# EAGLE board TESTOMATIC-v2_2 (EAGLE 9.7.0)
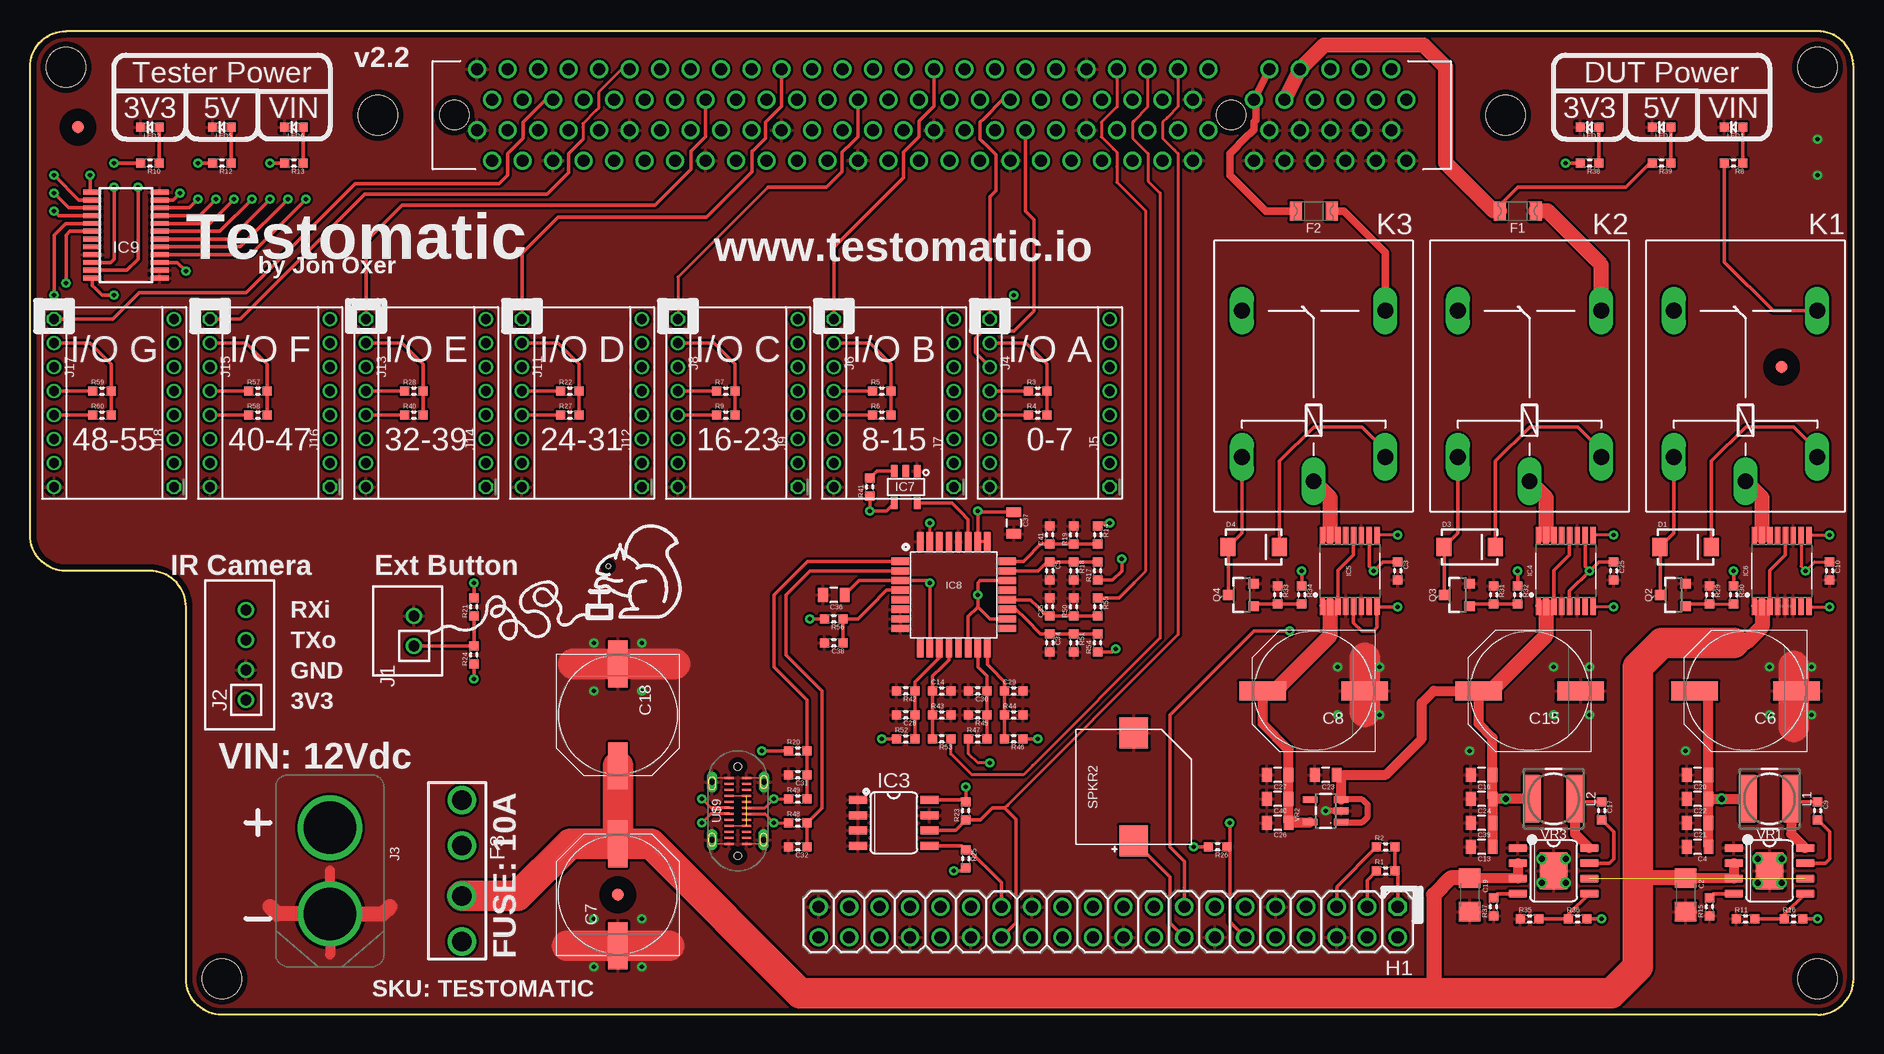
[diagram p4: board, top side]
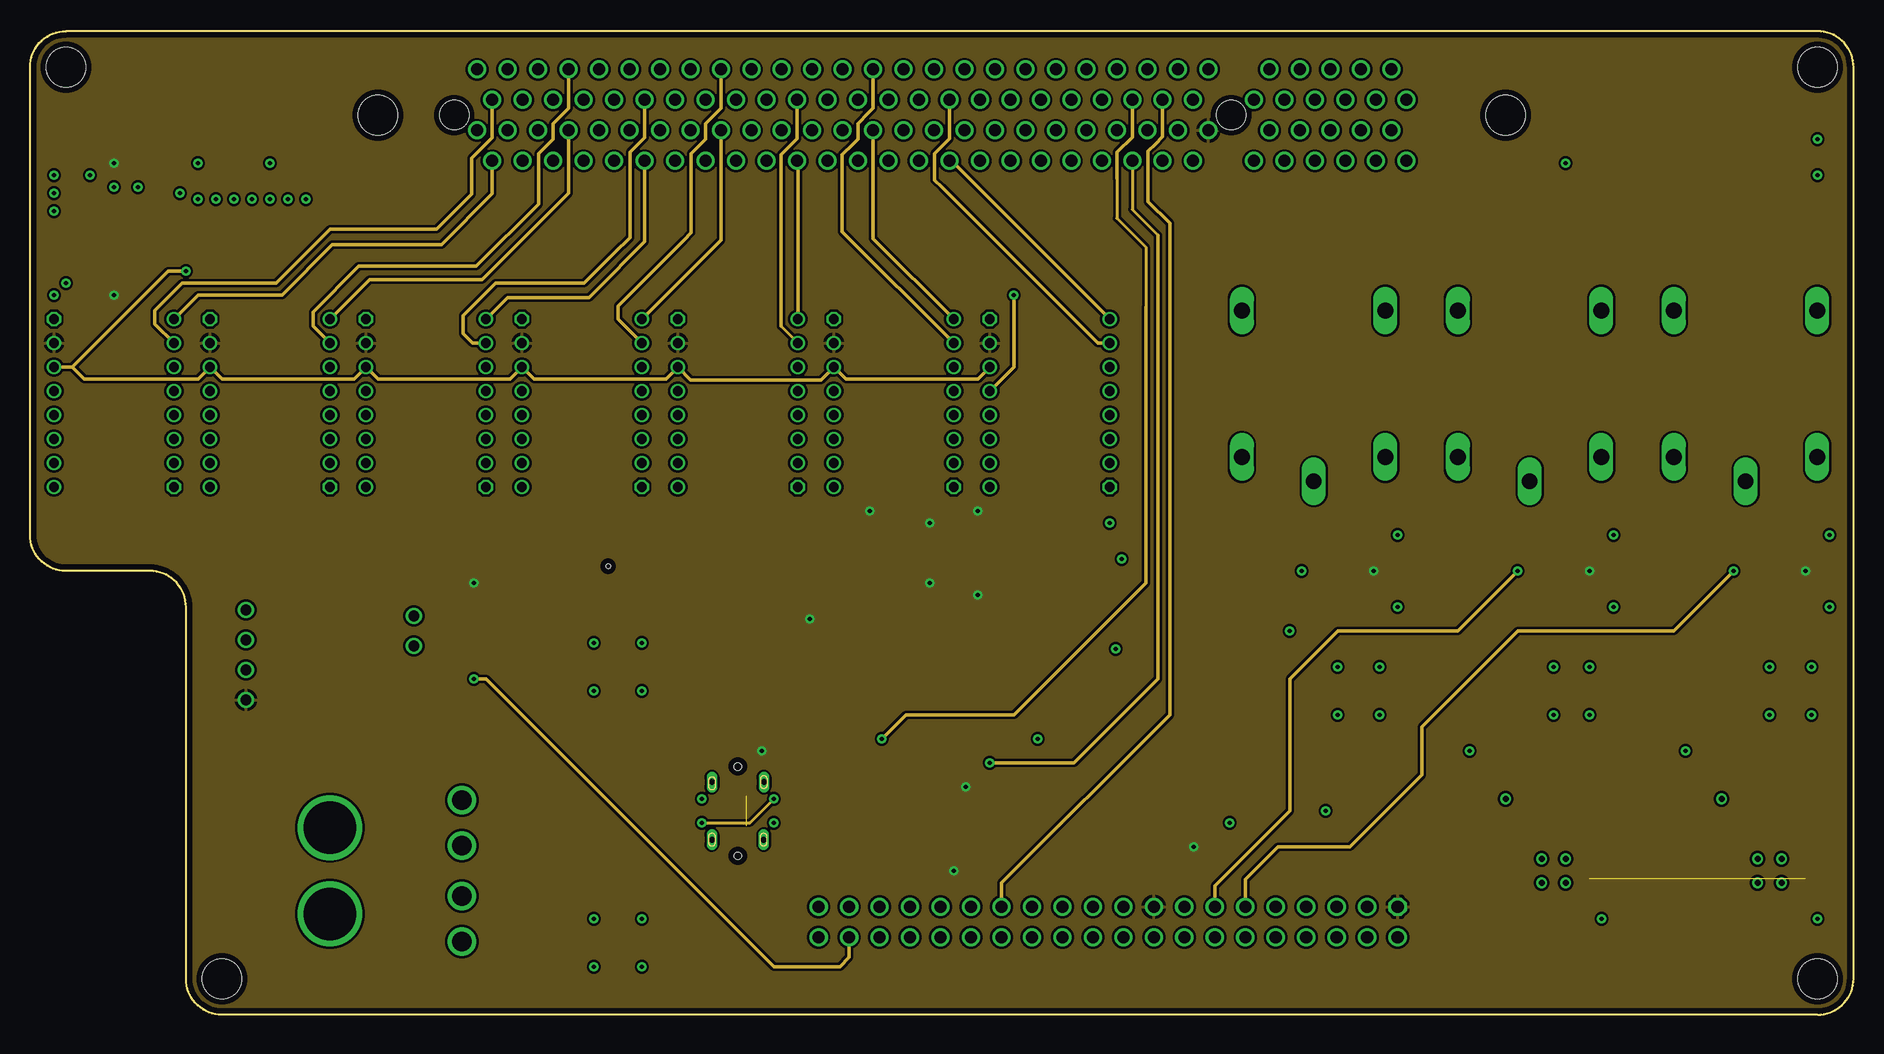
[diagram p5: board, inner layer Route2]
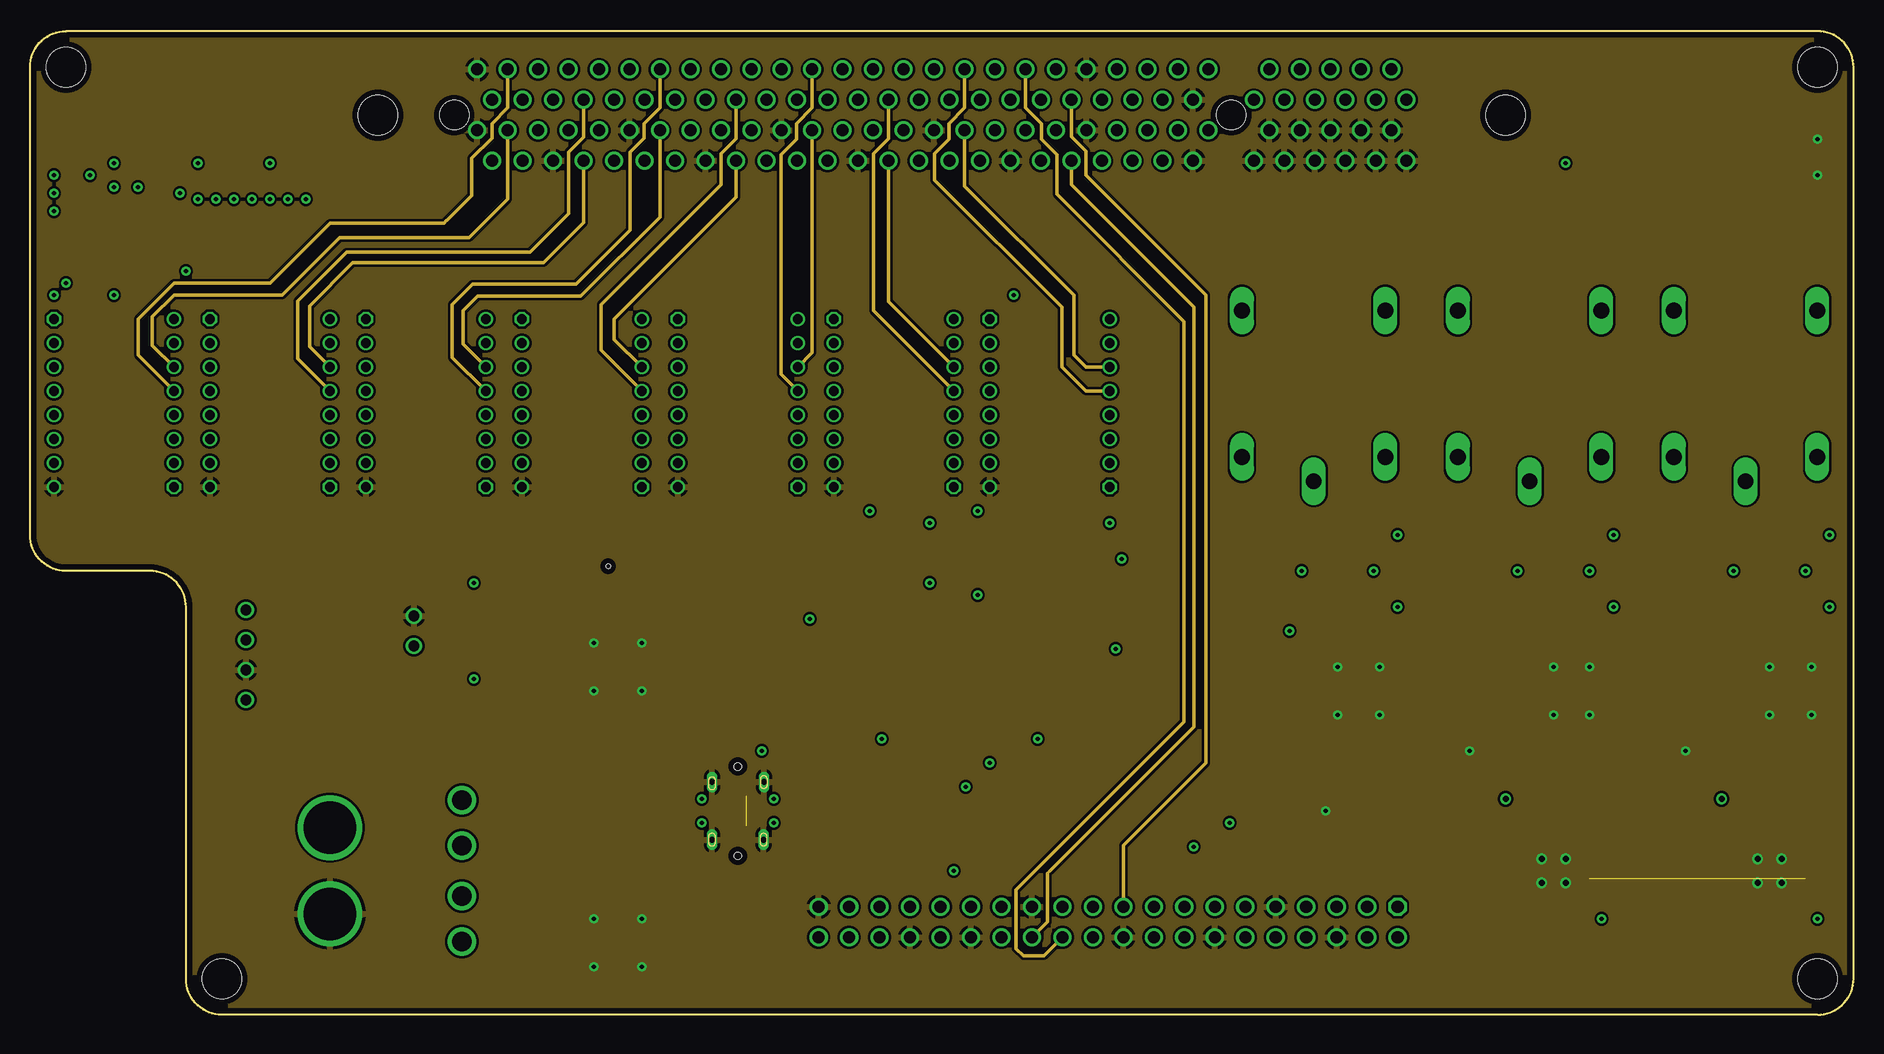
[diagram p6: board, inner layer Route3]
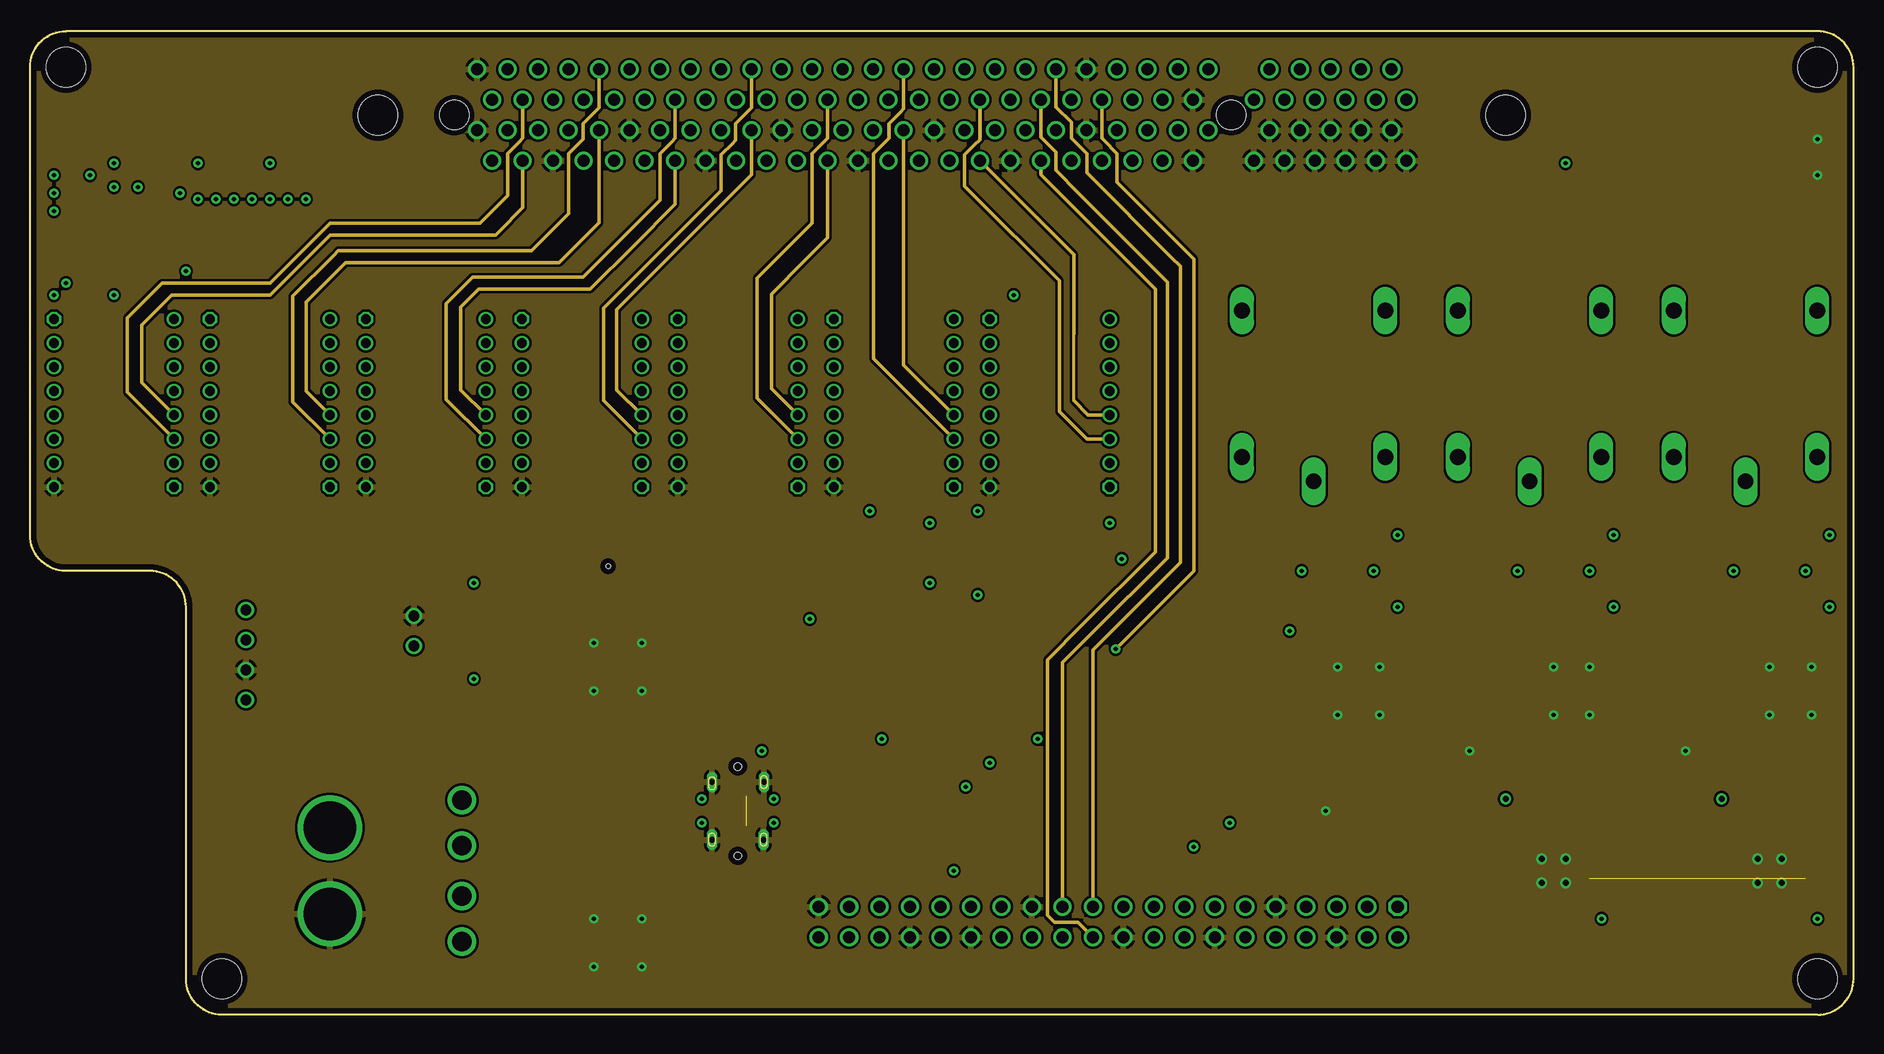
[diagram p7: board, inner layer Route14]
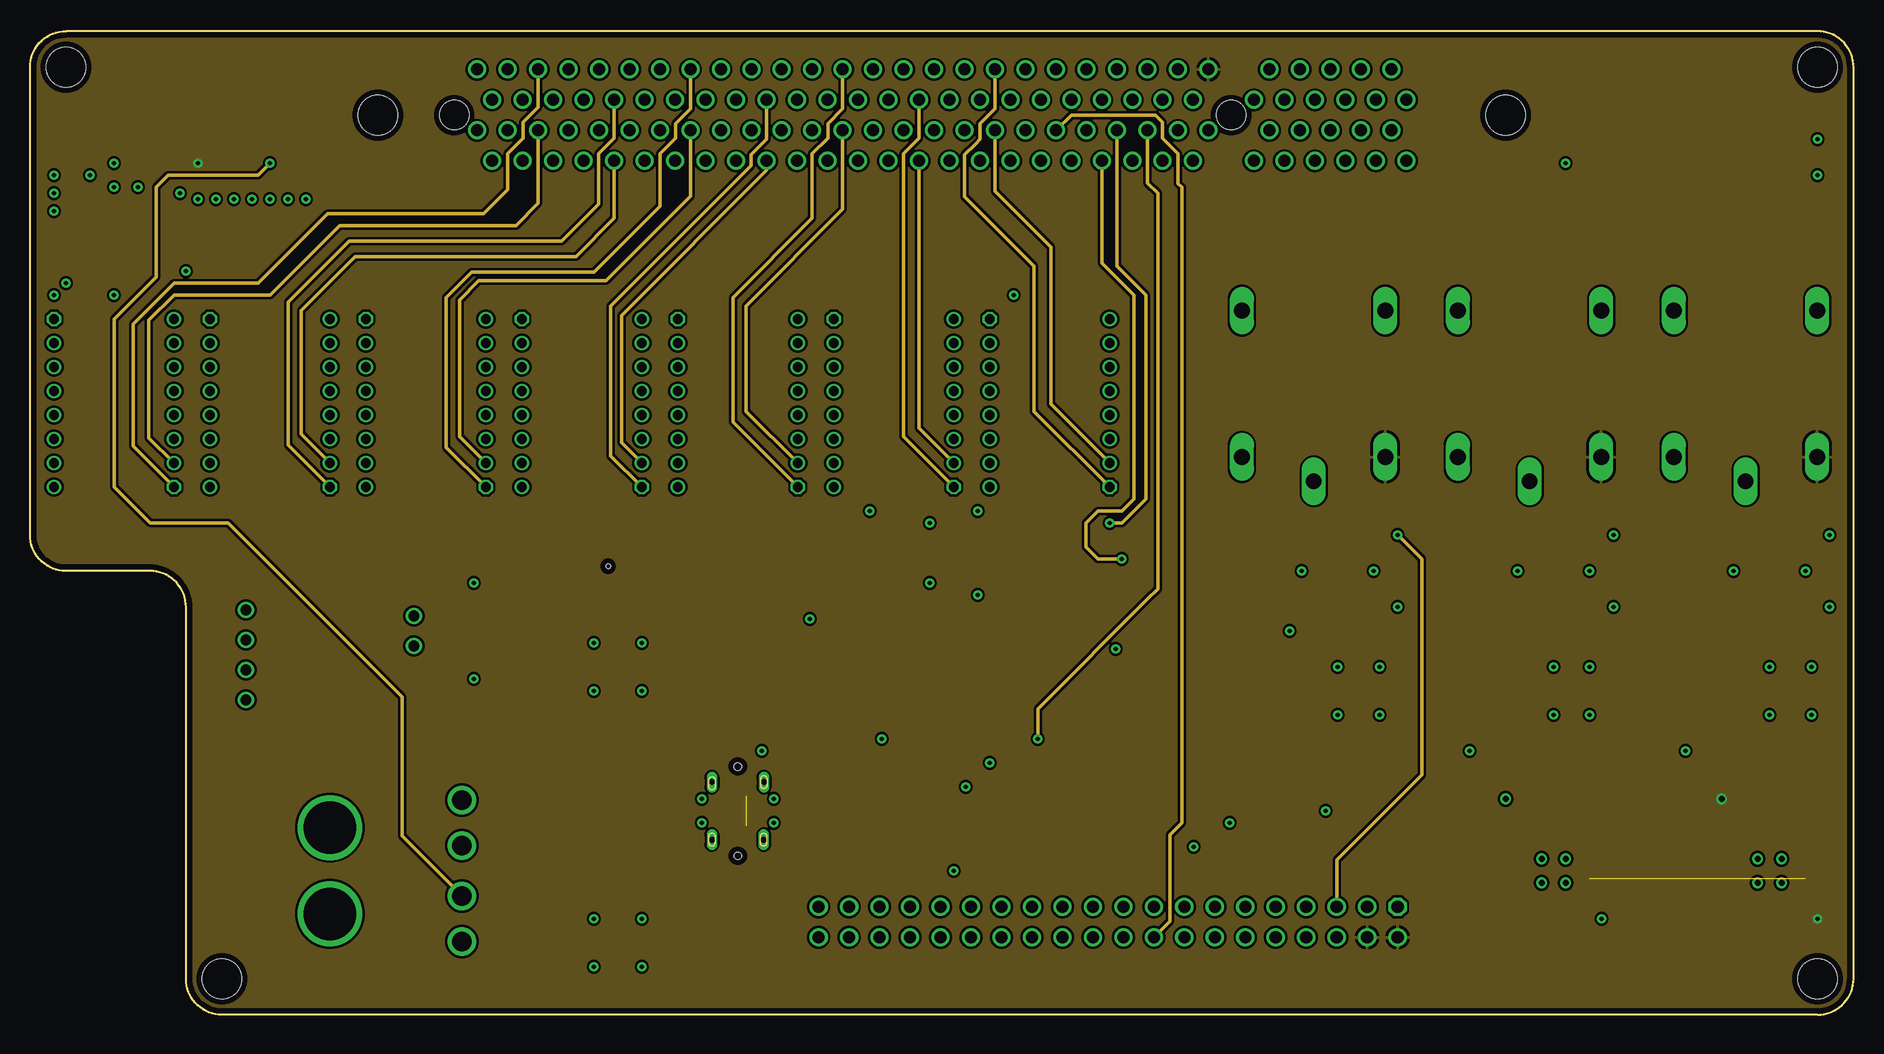
[diagram p8: board, inner layer Route15]
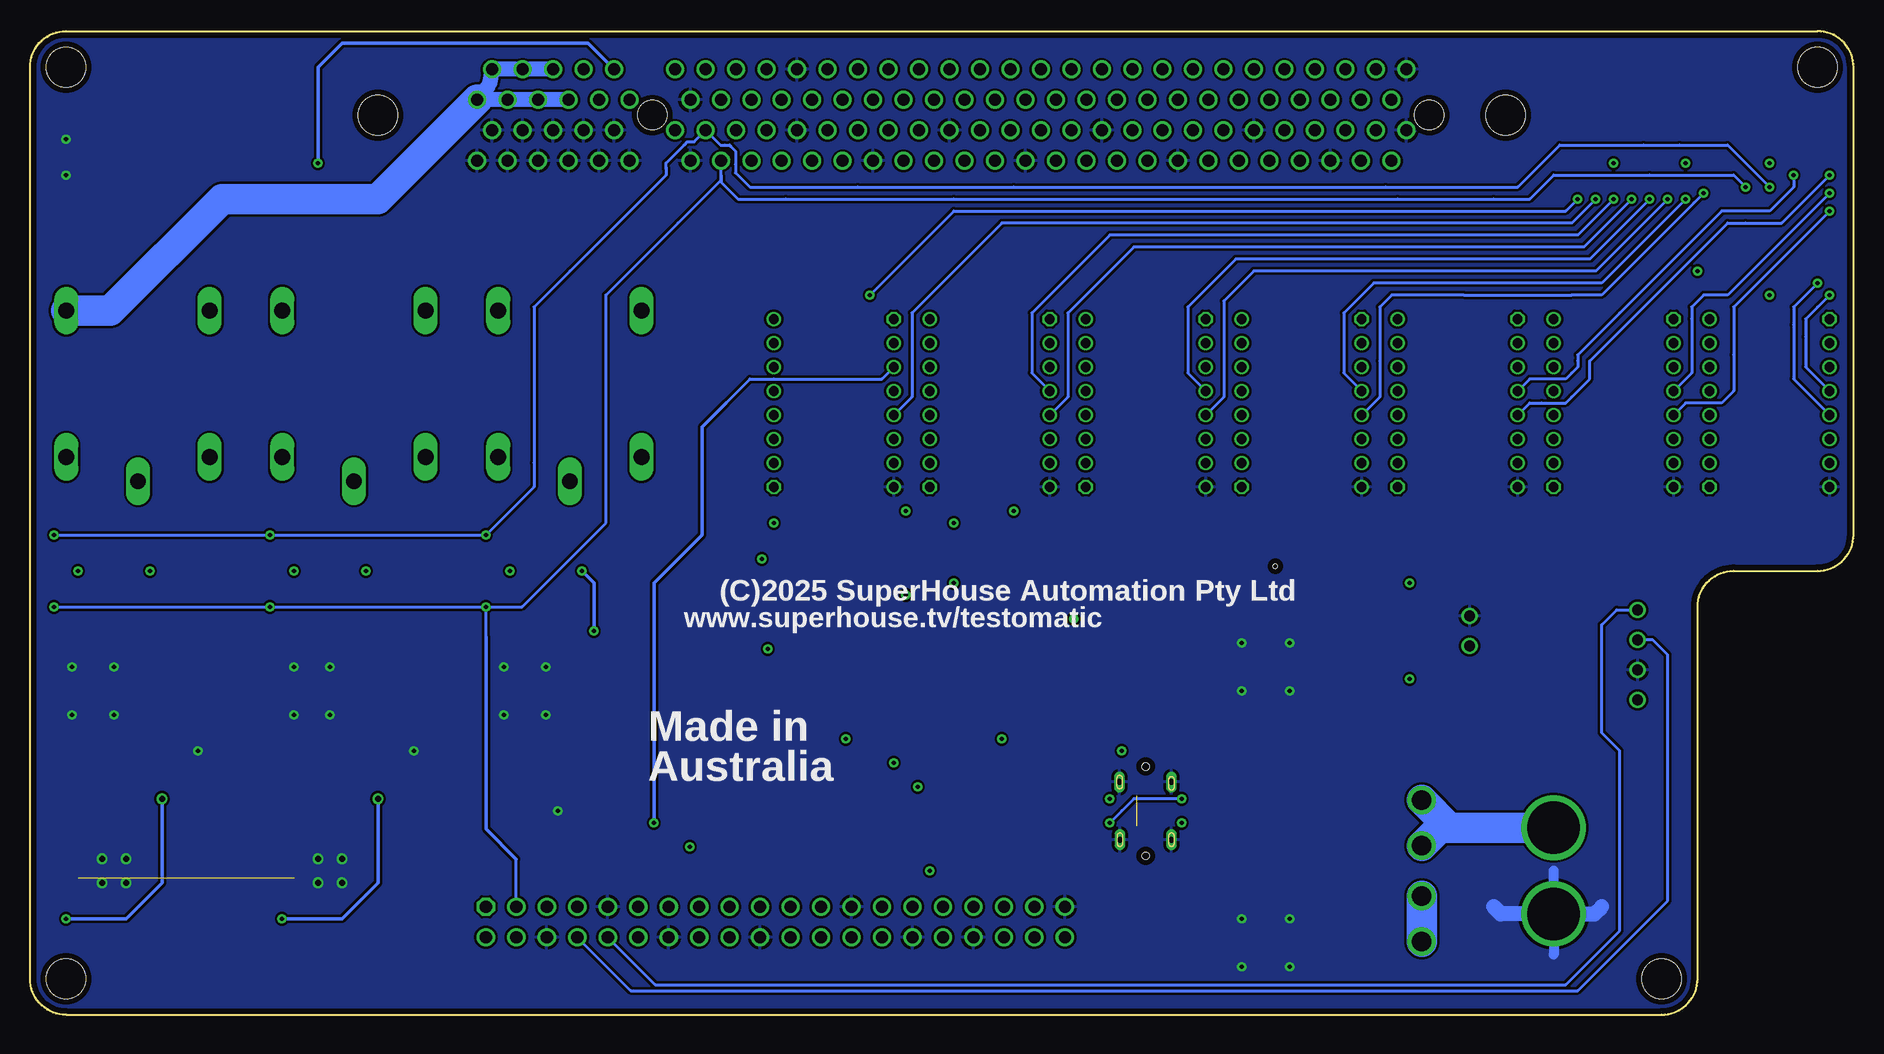
[diagram p9: board, bottom side, seen from below]

Size 152 x 82 mm. Coordinates in mm from the lower left corner, seen from the top.
Outline: 149,0 16,0 arc-90 13,3 13,34 arc90 10,37 3,37 arc-90 0,40 0,79 arc-90 3,82 149,82 arc-90 152,79 152,3 arc-90 149,0
Copper layers (1+2*3+14*15+16): Top 0.035mm / dielectric 1.5mm / Route2 0.035mm / dielectric 0.15mm / Route3 0.035mm / dielectric 0.2mm / Route14 0.035mm / dielectric 0.15mm / Route15 0.035mm / dielectric 0.2mm / Bottom 0.035mm
Design rules "SuperHouse-Design-Rules *": minimum track width 10mil, minimum drill 24mil, track to track 8mil, track to pad 8mil, pad to pad 8mil, via to via 8mil, smd to smd 6mil, copper to edge 18mil, drill to drill 8mil, minimum pad ring 7mil, minimum via ring 8mil, stop-mask expansion 4mil, vias tented up to drill 0.5mm, thermal gap 10mil
Net classes: 0 Default: width 0.203 mm; 1 VCC: width 0.305 mm
Holes 0.35 mm at 48.2,37.4
Holes 3.3 mm at 149,79 149,3 16,3 3,79 29,75 123,75
tRestrict: area 145,53 to 147,55; area 48,9 to 50,11; area 3,73 to 5,75

## Footprints (pad centres in the part's own frame; a part is rotated, then mirrored left to right if it is on the bottom)
C1206 = smd 1.6 x 1.8: 1 -1.4,0; 2 1.4,0
C0603 = smd 0.762 x 0.762: 1 -0.762,0; 2 0.762,0
C0805 = smd 0.8 x 1.2: 1 -0.9,0; 2 0.9,0
PANASONIC_G = smd 3.9 x 1.6: + 4.25,0; - -4.25,0
SMA-DIODE = smd 1.27 x 1.47: A -2.15,0; C 2.15,0
1206 = smd 1 x 1.6: 1 -1.5,0; 2 1.5,0
MCCQ-122 = drill 1.6: 1 -5.9,0; 2 -2.1,0; 3 2.1,0; 4 5.9,0
FIDUCIAL-1X2.5 = smd 1 x 1: 1 0,0
2X20-P = drill 1.016 octagon: 1 0,0 | drill 1.016: 2 0,2.54; 3 2.54,0; 4 2.54,2.54; 5 5.08,0; 6 5.08,2.54; 7 7.62,0; 8 7.62,2.54; 9 10.16,0; 10 10.16,2.54; 11 12.7,0; 12 12.7,2.54; 13 15.24,0; 14 15.24,2.54; 15 17.78,0; 16 17.78,2.54; 17 20.32,0; 18 20.32,2.54; 19 22.86,0; 20 22.86,2.54; 21 25.4,0; 22 25.4,2.54; 23 27.94,0; 24 27.94,2.54; 25 30.48,0; 26 30.48,2.54; 27 33.02,0; 28 33.02,2.54; 29 35.56,0; 30 35.56,2.54; 31 38.1,0; 32 38.1,2.54; 33 40.64,0; 34 40.64,2.54; 35 43.18,0; 36 43.18,2.54; 37 45.72,0; 38 45.72,2.54; 39 48.26,0; 40 48.26,2.54
SOIC8 = smd 1.524 x 0.66: 1 -2.973,1.905; 2 -2.973,0.635; 3 -2.973,-0.635; 4 -2.973,-1.905; 5 2.973,-1.905; 6 2.973,-0.635; 7 2.973,0.635; 8 2.973,1.905
TSSOP-16 = smd 1.5 x 0.45: 1 -2.9,2.275; 2 -2.9,1.625; 3 -2.9,0.975; 4 -2.9,0.325; 5 -2.9,-0.325; 6 -2.9,-0.975; 7 -2.9,-1.625; 8 -2.9,-2.275; 9 2.9,-2.275; 10 2.9,-1.625; 11 2.9,-0.975; 12 2.9,-0.325; 13 2.9,0.325; 14 2.9,0.975; 15 2.9,1.625; 16 2.9,2.275
SOT-23-5 = smd 1 x 0.55: 1 -1.35,0.95; 2 -1.35,0; 3 -1.35,-0.95; 4 1.35,-0.95; 5 1.35,0.95
LQFP32 = smd 1.5 x 0.55: 1 -4.45,2.8; 2 -4.45,2; 3 -4.45,1.2; 4 -4.45,0.4; 5 -4.45,-0.4; 6 -4.45,-1.2; 7 -4.45,-2; 8 -4.45,-2.8; 17 4.45,-2.8; 18 4.45,-2; 19 4.45,-1.2; 20 4.45,-0.4; 21 4.45,0.4; 22 4.45,1.2; 23 4.45,2; 24 4.45,2.8 | smd 0.55 x 1.5: 9 -2.8,-4.45; 10 -2,-4.45; 11 -1.2,-4.45; 12 -0.4,-4.45; 13 0.4,-4.45; 14 1.2,-4.45; 15 2,-4.45; 16 2.8,-4.45; 25 2.8,4.45; 26 2,4.45; 27 1.2,4.45; 28 0.4,4.45; 29 -0.4,4.45; 30 -1.2,4.45; 31 -2,4.45; 32 -2.8,4.45
TSSOP24 = smd 1.5 x 0.4: 1 -2.8,3.575; 2 -2.8,2.925; 3 -2.8,2.275; 4 -2.8,1.625; 5 -2.8,0.975; 6 -2.8,0.325; 7 -2.8,-0.325; 8 -2.8,-0.975; 9 -2.8,-1.625; 10 -2.8,-2.275; 11 -2.8,-2.925; 12 -2.8,-3.575; 13 2.8,-3.575; 14 2.8,-2.925; 15 2.8,-2.275; 16 2.8,-1.625; 17 2.8,-0.975; 18 2.8,-0.325; 19 2.8,0.325; 20 2.8,0.975; 21 2.8,1.625; 22 2.8,2.275; 23 2.8,2.925; 24 2.8,3.575
JST-B2B-XH-A = drill 0.9: 1 -1.25,0; 2 1.25,0
JST-B4B-XH-A = drill 0.9: 1 -3.75,0; 2 -1.25,0; 3 1.25,0; 4 3.75,0
XT60PW-M-V = drill 4.4: + -3.6,0; - 3.6,0
1X8-2.00-S = drill 0.8 octagon: 1 -7,0 | drill 0.8: 2 -5,0; 3 -3,0; 4 -1,0; 5 1,0; 6 3,0; 7 5,0; 8 7,0
PCI-SLOT = drill 1: A1 -38.735,3.81; A2 -37.465,1.27; A3 -36.195,3.81; A4 -34.925,1.27; A5 -33.655,3.81; A6 -32.385,1.27; A7 -31.115,3.81; A8 -29.845,1.27; A9 -28.575,3.81; A10 -27.305,1.27; A11 -26.035,3.81; A14 -22.225,1.27; A15 -20.955,3.81; A16 -19.685,1.27; A17 -18.415,3.81; A18 -17.145,1.27; A19 -15.875,3.81; A20 -14.605,1.27; A21 -13.335,3.81; A22 -12.065,1.27; A23 -10.795,3.81; A24 -9.525,1.27; A25 -8.255,3.81; A26 -6.985,1.27; A27 -5.715,3.81; A28 -4.445,1.27; A29 -3.175,3.81; A30 -1.905,1.27; A31 -0.635,3.81; A32 0.635,1.27; A33 1.905,3.81; A34 3.175,1.27; A35 4.445,3.81; A36 5.715,1.27; A37 6.985,3.81; A38 8.255,1.27; A39 9.525,3.81; A40 10.795,1.27; A41 12.065,3.81; A42 13.335,1.27; A43 14.605,3.81; A44 15.875,1.27; A45 17.145,3.81; A46 18.415,1.27; A47 19.685,3.81; A48 20.955,1.27; A49 22.225,3.81; A50 23.495,1.27; A51 24.765,3.81; A52 26.035,1.27; A53 27.305,3.81; A54 28.575,1.27; A55 29.845,3.81; A56 31.115,1.27; A57 32.385,3.81; A58 33.655,1.27; A59 34.925,3.81; A60 36.195,1.27; A61 37.465,3.81; A62 38.735,1.27; B1 -38.735,-1.27; B2 -37.465,-3.81; B3 -36.195,-1.27; B4 -34.925,-3.81; B5 -33.655,-1.27; B6 -32.385,-3.81; B7 -31.115,-1.27; B8 -29.845,-3.81; B9 -28.575,-1.27; B10 -27.305,-3.81; B11 -26.035,-1.27; B14 -22.225,-3.81; B15 -20.955,-1.27; B16 -19.685,-3.81; B17 -18.415,-1.27; B18 -17.145,-3.81; B19 -15.875,-1.27; B20 -14.605,-3.81; B21 -13.335,-1.27; B22 -12.065,-3.81; B23 -10.795,-1.27; B24 -9.525,-3.81; B25 -8.255,-1.27; B26 -6.985,-3.81; B27 -5.715,-1.27; B28 -4.445,-3.81; B29 -3.175,-1.27; B30 -1.905,-3.81; B31 -0.635,-1.27; B32 0.635,-3.81; B33 1.905,-1.27; B34 3.175,-3.81; B35 4.445,-1.27; B36 5.715,-3.81; B37 6.985,-1.27; B38 8.255,-3.81; B39 9.525,-1.27; B40 10.795,-3.81; B41 12.065,-1.27; B42 13.335,-3.81; B43 14.605,-1.27; B44 15.875,-3.81; B45 17.145,-1.27; B46 18.415,-3.81; B47 19.685,-1.27; B48 20.955,-3.81; B49 22.225,-1.27; B50 23.495,-3.81; B51 24.765,-1.27; B52 26.035,-3.81; B53 27.305,-1.27; B54 28.575,-3.81; B55 29.845,-1.27; B56 31.115,-3.81; B57 32.385,-1.27; B58 33.655,-3.81; B59 34.925,-1.27; B60 36.195,-3.81; B61 37.465,-1.27; B62 38.735,-3.81 | hole 2.44: -24.13,0; 40.64,0
G5LE = drill 1.321 long: 1 -7.493,-5.969; 2 -7.493,5.969; O 4.699,5.969; P -9.525,0; S 4.699,-5.969
INDUCTOR-5045 = smd 4 x 1.5: 1 0,1.8; 2 0,-1.8
LED-0603 = smd 0.762 x 0.762: A -0.762,0; C 0.762,0
SOT23-3 = smd 0.8 x 0.9: 1 -0.95,-1; 2 0.95,-1; 3 0,1.1
R0603 = smd 0.762 x 0.762: 1 -0.762,0; 2 0.762,0
PIEZO-9.6X9.6-SMT = smd 2.6 x 2.4: 1 -4.5,0; 2 4.5,0
USB-C-VERT = smd 0.15 x 0.75: A1 -2.75,0.725; A2 -2.25,0.725; A3 -1.75,0.725; A4 -1.25,0.725; A5 -0.75,0.725; A6 -0.25,0.725; A7 0.25,0.725; A8 0.75,0.725; A9 1.25,0.725; A10 1.75,0.725; A11 2.25,0.725; A12 2.75,0.725; B1 2.75,-0.725; B2 2.25,-0.725; B3 1.75,-0.725; B4 1.25,-0.725; B5 0.75,-0.725; B6 0.25,-0.725; B7 -0.25,-0.725; B8 -0.75,-0.725; B9 -1.25,-0.725; B10 -1.75,-0.725; B11 -2.25,-0.725; B12 -2.75,-0.725 | drill 0.5 pad 0.7 long: FIX1 -2.4,-2.15; FIX2 -2.4,2.15; FIX3 2.4,2.15; FIX4 2.4,-2.17 | hole 0.6: 3.7,0; -3.75,0
HSOIC8 = smd 1.524 x 0.66: 1 -2.973,1.905; 2 -2.973,0.635; 3 -2.973,-0.635; 4 -2.973,-1.905; 5 2.973,-1.905; 6 2.973,-0.635; 7 2.973,0.635; 8 2.973,1.905 | smd 2.4 x 3.1: TGND 0,0
SOT23-5 = smd 0.55 x 1.2: 1 -0.95,-1.3; 2 0,-1.3; 3 0.95,-1.3; 4 0.95,1.3; 5 -0.95,1.3

## Placement (x,y rotation side)
C2  4.7uF  [C1206]  138,10 270 top
C3  100nF  [C0603]  114,37 270 top
C4  22uF  [C0805]  139,14 180 top
C5  22p  [C0603]  85,37 270 top
C6  220uF  [PANASONIC_G]  143,27 180 top
C7  220uF  [PANASONIC_G]  49,10 90 top
C8  220uF  [PANASONIC_G]  107,27 180 top
C9  100nF  [C0603]  149,17 270 top
C10  100nF  [C0603]  150,37 270 top
C13  22uF  [C0805]  121,14 180 top
C14  22p  [C0603]  76,27 0 top
C15  220uF  [PANASONIC_G]  125,27 180 top
C16  22uF  [C0805]  121,20 180 top
C17  100nF  [C0603]  131,17 270 top
C18  220uF  [PANASONIC_G]  49,25 270 top
C19  4.7uF  [C1206]  120,10 270 top
C20  22uF  [C0805]  139,20 180 top
C21  22uF  [C0805]  139,16 180 top
C22  22uF  [C0805]  139,18 180 top
C23  22uF  [C0805]  108,20 180 top
C24  22uF  [C0805]  121,18 180 top
C25  100nF  [C0603]  132,37 270 top
C26  22uF  [C0805]  104,16 180 top
C27  22uF  [C0805]  104,20 180 top
C28  22p  [C0603]  73,25 180 top
C29  22p  [C0603]  82,27 0 top
C30  22p  [C0603]  79,27 180 top
C31  22p  [C0603]  64,20 180 top
C32  22p  [C0603]  64,14 180 top
C34  22p  [C0603]  85,31 270 top
C35  22p  [C0603]  85,34 90 top
C36  10uF  [C0805]  67,35 180 top
C37  10uF  [C0805]  82,41 270 top
C38  100nF  [C0603]  67,31 180 top
C39  22uF  [C0805]  121,16 180 top
C40  22uF  [C0805]  104,18 180 top
C41  22p  [C0603]  85,40 90 top
D1  SS56  [SMA-DIODE]  138,39 0 top
D3  SS56  [SMA-DIODE]  120,39 0 top
D4  SS56  [SMA-DIODE]  102,39 0 top
F1  1A  [1206]  124,67 180 top
F2  1A  [1206]  107,67 180 top
F3  10A  [MCCQ-122]  36,12 270 top
FID1  FIDUCIAL1X2.5  [FIDUCIAL-1X2.5]  146,54 0 top
FID2  FIDUCIAL1X2.5  [FIDUCIAL-1X2.5]  49,10 0 top
FID3  FIDUCIAL1X2.5  [FIDUCIAL-1X2.5]  4,74 270 top
H1  RasPi  [2X20-P]  114,9 180 top
IC3  CAT24C32-SOIC8  [SOIC8]  72,16 0 top
IC4  INA260  [TSSOP-16]  128,37 90 top
IC5  INA260  [TSSOP-16]  110,37 90 top
IC6  INA260  [TSSOP-16]  146,37 90 top
IC7  48MHz  [SOT-23-5]  73,44 270 top
IC8  TUSB2046-LQFP32  [LQFP32]  77,35 0 top
IC9  TCA9548A  [TSSOP24]  8,65 180 top
J1  [JST-B2B-XH-A]  32,32 90 top
J2  [JST-B4B-XH-A]  18,30 90 top
J3  XT60M-V  [XT60PW-M-V]  25,12 270 top
J4  A1  [1X8-2.00-S]  80,51 270 top
J5  A2  [1X8-2.00-S]  90,51 90 top
J6  B1  [1X8-2.00-S]  67,51 270 top
J7  B2  [1X8-2.00-S]  77,51 90 top
J8  C1  [1X8-2.00-S]  54,51 270 top
J9  C2  [1X8-2.00-S]  64,51 90 top
J10  PCI-SLOT  [PCI-SLOT]  76,75 180 top
J11  D1  [1X8-2.00-S]  41,51 270 top
J12  D2  [1X8-2.00-S]  51,51 90 top
J13  E1  [1X8-2.00-S]  28,51 270 top
J14  E2  [1X8-2.00-S]  38,51 90 top
J15  F1  [1X8-2.00-S]  15,51 270 top
J16  F2  [1X8-2.00-S]  25,51 90 top
J17  G2  [1X8-2.00-S]  2,51 270 top
J18  G2  [1X8-2.00-S]  12,51 90 top
K1  G5LE  [G5LE]  143,54 90 top
K2  G5LE  [G5LE]  125,54 90 top
K3  G5LE  [G5LE]  107,54 90 top
L1  VLS5045 15uH  [INDUCTOR-5045]  145,18 270 top
L2  VLS5045 15uH  [INDUCTOR-5045]  127,18 270 top
LED1  GREEN  [LED-0603]  142,74 180 top
LED2  BLUE  [LED-0603]  10,74 180 top
LED3  BLUE  [LED-0603]  130,74 180 top
LED4  RED  [LED-0603]  136,74 180 top
LED5  RED  [LED-0603]  16,74 180 top
LED6  GREEN  [LED-0603]  22,74 180 top
Q2  2N7002  [SOT23-3]  137,35 90 top
Q3  2N7002  [SOT23-3]  119,35 90 top
Q4  2N7002  [SOT23-3]  101,35 90 top
R1  4K7  [R0603]  113,12 0 top
R2  4K7  [R0603]  113,14 0 top
R3  4K7  [R0603]  84,52 0 top
R4  4K7  [R0603]  84,50 0 top
R5  4K7  [R0603]  71,52 0 top
R6  4K7  [R0603]  71,50 0 top
R7  4K7  [R0603]  58,52 0 top
R8  10K  [R0603]  142,71 180 top
R9  4K7  [R0603]  58,50 0 top
R10  1K5  [R0603]  10,71 180 top
R11  24K9  [R0603]  143,8 0 top
R12  2K2  [R0603]  16,71 180 top
R13  10K  [R0603]  22,71 180 top
R14  30R  [R0603]  89,40 270 top
R15  64K9  [R0603]  140,9 90 top
R16  100K  [R0603]  147,8 0 top
R17  30R  [R0603]  89,37 90 top
R18  15k  [R0603]  87,37 270 top
R19  15k  [R0603]  87,40 90 top
R20  1K5  [R0603]  64,22 0 top
R21  10K  [R0603]  37,34 90 top
R22  4K7  [R0603]  45,52 0 top
R23  4K7  [R0603]  78,17 90 top
R24  1K  [R0603]  37,30 90 top
R25  4K7  [R0603]  78,13 270 top
R26  10K  [R0603]  99,14 180 top
R27  4K7  [R0603]  45,50 0 top
R28  4K7  [R0603]  32,52 0 top
R29  10K  [R0603]  140,35 270 top
R30  1K  [R0603]  142,35 270 top
R31  10K  [R0603]  122,35 270 top
R32  1K  [R0603]  124,35 270 top
R33  10K  [R0603]  104,35 270 top
R34  1K  [R0603]  106,35 270 top
R35  24K9  [R0603]  125,8 0 top
R36  100K  [R0603]  129,8 0 top
R37  64K9  [R0603]  122,9 90 top
R38  1K5  [R0603]  130,71 180 top
R39  2k2  [R0603]  136,71 180 top
R40  4K7  [R0603]  32,50 0 top
R41  1k  [R0603]  70,44 90 top
R42  15k  [R0603]  73,27 180 top
R43  15k  [R0603]  76,25 0 top
R44  15k  [R0603]  82,25 0 top
R45  15k  [R0603]  79,25 180 top
R46  30R  [R0603]  82,23 180 top
R47  30R  [R0603]  79,23 0 top
R48  30R  [R0603]  64,16 0 top
R49  30R  [R0603]  64,18 0 top
R50  15k  [R0603]  87,34 90 top
R51  15k  [R0603]  87,31 270 top
R52  30R  [R0603]  73,23 0 top
R53  30R  [R0603]  76,23 180 top
R54  30R  [R0603]  89,31 90 top
R55  30R  [R0603]  89,34 270 top
R56  10K  [R0603]  67,33 180 top
R57  4K7  [R0603]  19,52 0 top
R58  4K7  [R0603]  19,50 0 top
R59  4K7  [R0603]  6,52 0 top
R60  4K7  [R0603]  6,50 0 top
SPKR2  PIEZO  [PIEZO-9.6X9.6-SMT]  92,19 90 top
U$9  USB-C-VER  [USB-C-VERT]  59,17 90 top
VR1  LMR38020  [HSOIC8]  145,12 0 top
VR2  AP2112KSOT25  [SOT23-5]  108,17 90 top
VR3  LMR38020  [HSOIC8]  127,12 0 top

## Tracks (layer width: path | path; a pad name or v marks a point on that pad's centre or on a via)
3.3V  (via drill 0.35)
  Top 0.254: IC6.10 147.62,37.38 v148,37 148.76,37.76 C10.1 | IC8.31 v75,41
  Top 0.305: IC4.10 129.62,38.38 129.62,37.38 v130,37 | R10.2 v7,71 | IC8.22 79.2,36.2 79,36 v79,35 79,34 | IC8.18 80,33 79,34 | C37.1 79.27,41.9 v79,42 IC8.26 IC8.25 | IC8.14 78.2,33.2 79,34 | C36.1 69.1,36.2 IC8.3 73.8,36.2 74.8,36.2 v75,36 75,35 75,33 IC8.10 | R56.2 v65,33 | R20.1 v61,22 | R21.2 v37,36 | IC5.10 111.62,37.38 v112,37 112.76,37.76 C3.1 | v130,37 130.76,37.76 C25.1 | IC4.5 128.32,35.33 v130,37 | v78,19 R23.2 77.86,17.91 IC3.8 | R26.2 v97,14 | R25.2 77.76,12 v77,12 | R41.1 v70,42 71.4,42 IC7.4 | R60.2 R59.2 6.76,54.24 6,55 5,56 J17.2 | R58.2 R57.2 19.76,54.24 19,55 18,56 J15.2 | R40.2 R28.2 32.76,54.24 32,55 31,56 J13.2 | R27.2 R22.2 45.76,54.24 45,55 44,56 J11.2 | R9.2 R7.2 58.76,54.24 58,55 57,56 J8.2 | R6.2 R5.2 71.76,54.24 71,55 70,56 J6.2 | R4.2 R3.2 84.76,54.24 84,55 83,56 J4.2 | R2.2 R1.2 114,11.76 H1.1 | IC9.24 5.2,60.8 5.5,60.5 6,60 v7,60
  pour Route2: 0.08,0.08 151.92,0.08 151.92,81.92 0.08,81.92
5V  (via drill 0.35, 0.5)
  Top 0.305: R16.2 v149,8 | D4.C 104.15,46.15 107,49 111,49 112.97,47.03 K3.1 | D3.C 122.15,46.15 125,49 129,49 130.97,47.03 K2.1 | D1.C 140.15,46.15 143,49 147,49 148.97,47.03 K1.1 | R12.2 v14,71
  Top 0.406: 138.5,27.25 C6.+
  Top 0.813: 143,19 143,18.2 L1.2 v141,18 C22.1 | C4.1 C21.1 C22.1 | C22.1 C20.1 139.9,26.9 140,27 139.75,27.25 138.5,27.25
  Bottom 0.305: v149,8 144,8 141,11 v141,18
  pour Route15: 0.08,0.08 151.92,0.08 151.92,81.92 0.08,81.92
!USB_RESET
  Top 0.305: IC8.4 71.4,35.4 70,34 69,33 R56.1 C38.1
A_SCL  (via drill 0.35)
  Top 0.305: R4.1 J4.5 | IC9.5 17.52,64.03 v21.5,68
  Bottom 0.254: v21.5,68 23.5,66 71,66 78.5,58.5 78.5,51.5 J4.5
A_SDA  (via drill 0.35)
  Top 0.305: R3.1 J4.4 | IC9.4 18.38,63.38 v23,68
  Route2 0.305: v82,60 82,54 J4.4
  Bottom 0.254: v23,68 24,67 75,67 v82,60
B_SCL  (via drill 0.35)
  Top 0.305: R6.1 J6.5 | IC9.7 15.82,65.33 v18.5,68
  Bottom 0.254: v18.5,68 22.5,64 60,64 65.5,58.5 65.5,51.5 J6.5
B_SDA  (via drill 0.35)
  Top 0.305: R5.1 J6.4 | IC9.6 16.68,64.67 v20,68
  Bottom 0.254: v20,68 23,65 62,65 68.5,58.5 68.5,53.5 J6.4
C_SCL  (via drill 0.35)
  Top 0.305: R9.1 J8.5 | IC9.9 14.12,66.62 v15.5,68
  Bottom 0.254: v15.5,68 21.5,62 50,62 52.5,59.5 52.5,51.5 J8.5
C_SDA  (via drill 0.35)
  Top 0.305: R7.1 J8.4 | IC9.8 14.97,65.97 v17,68
  Bottom 0.254: v17,68 22,63 51.5,63 55.5,59 55.5,53.5 J8.4
CLK
  Top 0.305: IC7.5 76.85,42.65 77.5,42 78.2,41.3 IC8.27
D_SCL  (via drill 0.35)
  Top 0.305: R27.1 J11.5 | IC9.11 11.93,67.92 v12.5,68.5
  Bottom 0.254: v12.5,68.5 13.29,67.71 21,60 23.5,60 32.5,60 38.5,60 39.5,59 39.5,54.5 39.5,51.5 J11.5
D_SDA  (via drill 0.35)
  Top 0.305: R22.1 J11.4 | IC9.10 13.28,67.28 v14,68
  Bottom 0.254: v14,68 21,61 40,61 42.5,58.5 42.5,53.5 J11.4
DM0
  Top 0.305: C32.1 R48.2 66,17.24 66,27 63,30 63,35 65,37 IC8.2
DM1
  Top 0.305: R52.2 C28.1 R42.1 73.76,27.76 75,29 75.8,29.8 IC8.11
DM2
  Top 0.305: R47.2 R45.1 C30.1 79.76,28.24 79,29 IC8.15
DM3
  Top 0.305: IC8.19 82.2,33.8 83,33 84.24,31.76 C34.1 R51.1 R54.2
DM4
  Top 0.305: R17.2 R18.1 C5.1 84.76,37.76 84,37 IC8.23
DP0
  Top 0.305: R49.2 C31.1 R20.2 64.76,26.24 62,29 62,35 64.8,37.8 IC8.1
DP1
  Top 0.305: IC8.12 76.6,29.6 76,29 75.24,28.24 C14.1 R43.1 R53.2
DP2
  Top 0.305: R46.2 R44.1 C29.1 81.24,27.76 80,29 79.8,29.2 IC8.16
DP3
  Top 0.305: R55.2 R50.1 C35.1 84.76,33.24 84,34 83.4,34.6 IC8.20
DP4
  Top 0.305: IC8.24 82.8,37.8 83,38 84.24,39.24 C41.1 R19.1 R14.2
DUT_3V3  (via drill 0.35)
  Top 0.305: v128,71 R38.2
  Top 0.61: F2.2 103,67 100,70 100,71 100,71.8 101.4,73.2 101.8,73.6 102,73.8 102,74.2 102,74.4 102.2,74.6 102.2,76.11 J10.B11 J10.B10
  Bottom 0.305: J10.B10 105.5,81 126,81 128,79 v128,71
DUT_3V3_RAW
  Top 0.305: IC5.12 110.33,38.33 109.03,37.02 IC5.3
  Top 0.508: IC5.3 IC5.2 IC5.1
  Top 0.813: VR2.5 106.65,16 C26.1 C40.1 C27.1 104.9,22.1 102.75,24.25 C8.+
  Top 1.27: C8.+ 103.75,27 108.38,31.62 IC5.2
DUT_5V
  Top 0.305: R39.2 135,71 133,69 124,69 122.5,67.5 F1.2
  Top 1.27: F1.2 122,67 118,71 118,79 116.17,80.83 108,80.83 107.87,80.83 J10.B8 J10.B9
DUT_5V_RAW  (via drill 0.35, 0.5)
  Top 0.305: IC4.12 128.32,38.33 127.03,37.02 IC4.3 | R36.2 v131,8
  Top 0.508: IC4.3 IC4.2 IC4.1 | VR2.3 111.05,17.95 111.5,17.5 111.5,16.5 111.05,16.05 VR2.1
  Top 0.813: L2.2 v123,18 C24.1 | C24.1 C16.1 121.9,23.1 120.75,24.25 C15.+ | 121.9,26.9 122,27 C15.+ | C24.1 C39.1 C13.1 | VR2.3 109.3,19.6 C23.1 113,20 116,23 116,26 117,27 C15.+
  Top 1.27: C15.+ 121.75,27 126.38,31.62 IC4.2
  Bottom 0.305: v131,8 126,8 123,11 v123,18
DUT_VIN
  Top 0.305: R8.2 141.24,62.76 145.3,58.7 K1.S
  Bottom 1.27: J10.B6 J10.B4 J10.B2 113.73,77.54 J10.B1 J10.B3 J10.B5 J10.B7
  Bottom 2.54: J10.B1 123,68 136,68 145.3,58.7 K1.S
E_SCL  (via drill 0.35)
  Top 0.305: R40.1 J13.5 | IC9.14 4.08,67.92 v2,70
  Bottom 0.254: J13.5 27,51 26,51 24,51 23.5,51.5 22,53 22,54.5 10.5,66 9,66 6,66 v2,70
E_SDA  (via drill 0.35)
  Top 0.305: R28.1 J13.4 | IC9.13 5,68.78 v5,70
  Bottom 0.254: v5,70 5,69 7,67 11,67 19.5,58.5 23,55 23,54.5 23,54 23.5,53.5 24,53 25,53 27,53 J13.4
F_SCL  (via drill 0.35)
  Top 0.305: J15.5 R58.1 | IC9.16 2.38,66.62 v2,67
  Bottom 0.254: v2,67 10,59 10,55 10,52 11,51 12.5,51 14,51 J15.5
F_SDA  (via drill 0.35)
  Top 0.305: J15.4 R57.1 | IC9.15 3.23,67.28 v2,68.5
  Bottom 0.254: v2,68.5 10.5,60 12.5,60 13.5,59 13.5,58 13.5,53.5 J15.4
G_SCL  (via drill 0.35)
  Top 0.305: v3,61 3,65 3.33,65.33 IC9.18 | R60.1 J17.5
  Bottom 0.254: v3,61 5,59 5,57.5 5,53 J17.5
G_SDA  (via drill 0.35)
  Top 0.305: IC9.17 2.98,65.97 2,65 2,61 v2,60 | R59.1 J17.4
  Bottom 0.254: v2,60 3,59 4,58 4,56.5 4,54 J17.4
GND  (via drill 0.35, 0.5)
  Top 0.127: U$9.B12 60.8,14.25 U$9.FIX1 | U$9.A1 57.2,14.25 U$9.FIX2 | U$9.A12 57.2,19.75 U$9.FIX3 | U$9.B1 60.82,19.75 U$9.FIX4
  Top 0.508: VR2.2 v108,17
  Top 0.813: 25,5 J3.- 25,12
  Top 1.27: 30,9 29.4,8.4 J3.- 20.6,8.4 20,9
  Top 2.54: 147,29.1 147,24 | 111.25,25.25 111.25,29.75 | 45.25,29.25 C18.- 53.75,29.25 | 44.75,5.75 C7.- 53.25,5.75
  Bottom 0.813: 25,12 J3.- 25,5
  Bottom 1.27: 30,9 29.4,8.4 J3.- 21.6,8.4 21,9
  other vias: 149,70 109,25 109,29 51,8 47,8 145,25 145,29 148.5,29 112.5,25 112.5,29 148.5,25 144,11 146,11 146,13 144,13 149,73 138,22 120,22 127,29 127,25 130,25 130,29 128,13 128,11 126,11 126,13 47,27 51,27 47,31 51,31 51,4 47,4
  pour Top: 0.08,0.08 151.92,0.08 151.92,81.92 0.08,81.92
  pour Bottom: 0.08,0.08 151.92,0.08 151.92,81.92 0.08,81.92
  pour Route3: 0.25,0.25 151.75,0.25 151.75,81.75 0.25,81.75
  pour Route14: 0.25,0.25 151.75,0.25 151.75,81.75 0.25,81.75
IO0_EEPROM_SDA
  Top 0.305: IC3.5 77.67,14.1 R25.1 78.12,13.88 80.98,11.02 H1.27
  Route2 0.305: J10.B17 94.42,73.22 93.8,72.6 93.2,72 93.2,70.7 93.2,69.7 93.2,67.8 95,66 95,25 80.98,10.98 H1.27
IO1_EEPROM_SCL
  Top 0.254: J10.B16 95.69,75.69 94.8,74.8 94.4,74.4 94.4,73.1 95.4,72.1 95.7,71.8 95.7,70.1 95.7,69.5 | 95.7,69.5 95.7,69.4 | 95.7,69.5 95.7,31.7 81.5,17.5
  Top 0.305: IC3.6 77.13,15.37 R23.1 79.24,16.24 80.24,17.24 81.24,17.24 | 82.2,10.2 82.2,10 | 82.2,10 82.2,7.68 H1.28 | 81.5,17.5 81.24,17.24 | 82.2,10 82.2,16.28 81.24,17.24
IO2_SDA  (via drill 0.35)
  Top 0.254: 148.38,34 IC6.8 148.38,34 | 148.38,34 v150,34 | v132,34 130.38,34 IC4.8 | 112.38,34 IC5.8 112.38,34
  Top 0.305: IC5.5 110.33,32.67 111,32 112,32 112.28,32.27 IC5.8 | v114,34 112.38,34 | v9,69 9,63 8.07,62.08 IC9.23 | R1.1 111.46,11.22 H1.3
  Bottom 0.254: v150,34 v132,34 v114,34 | v114,34 111,34 104,41 104,52 104,60 98,66 94.42,69.58 94.42,70 | 94.42,70 J10.A17 | H1.3 111.46,12.96 | 114,31.5 v114,34 | 94.42,70 94.42,69.42 93,68 89,68 75,68 38,68 30,68 27,68 25,70 17,70 10,70 v9,69
  Bottom 0.305: 111.46,12.96 114,15.5 114,31.5
IO3_SCL  (via drill 0.35)
  Top 0.254: 148.38,40 IC6.9 148.38,40 | 112.38,40 IC5.9 112.38,40 | 130.38,40 IC4.9 130.38,40 | 148.38,40 v150,40 | v132,40 130.38,40 | v114,40 112.38,40
  Top 0.305: v7,69 7,64 7,63 6.72,62.73 IC9.22 | R2.1 108.92,10.68 H1.5
  Route15 0.305: H1.5 108.92,12.92 113.5,17.5 116,20 116,31.5 116,38 v114,40
  Bottom 0.254: v150,40 v132,40 v114,40 110,44 110,46 110,59 107,62 99,70 99,70.5 | 99,70.67 99,70.5 | 99,70.5 99,71 97.5,72.5 97.23,72.77 96.64,72.77 J10.A16 94.45,72.5 94.1,72.5 93.7,72.5 | 93.6,72.4 93.2,72 93.2,70.9 93.2,70.2 92,69 83,69 70,69 39,69 28,69 24.5,72.5 17.5,72.5 14.5,72.5 10.5,72.5 v7,69
  Bottom 0.305: 93.7,72.5 93.6,72.4
IO7_CE1
  Route3 0.254: 84.8,11.8 85,12
  Route3 0.305: J10.A23 86.8,69.2 92,64 97,59 97,55 97,24 87,14 85,12 | H1.26 84.8,7.74 84.8,9 84.8,11.8
IO8_CE0
  Route3 0.305: H1.24 84.5,4.9 82.8,4.9 82.2,5.5 82.2,10.4 96.2,24.4 96.2,57.8 85.6,68.4 85.6,71.7 84.3,73 84.3,74.3 82.98,75.61 J10.B26
IO9_MISO
  Route14 0.254: 88.1,70.3 88.1,70.2
  Route14 0.305: J10.B24 85.53,75.67 86.8,74.4 86.8,73.5 86.8,73.1 87.9,72 88.1,71.8 88.1,70.3 | 88.1,70.2 95.2,63.1 95.9,62.4 95.9,55.2 95.9,37.7 90.1,31.9 89.1,30.9 88.6,30.4 H1.21
IO10_MOSI
  Route3 0.305: H1.19 91.14,14.14 98,21 98,60 88,70 88,72 86.8,73.2 J10.B23
IO11_SCK
  Route14 0.305: J10.B25 84.25,73.14 85.5,71.9 85.5,70.8 85.5,70.4 87.4,68.5 94.8,61.1 94.8,57.1 94.8,38.1 88.4,31.7 86.06,29.36 H1.23
IO14_IR_TXD
  Bottom 0.254: H1.8 101.92,2 23,2 15.5,9.5 15.5,30 16.75,31.25 J2.3
IO15_IR_RXD
  Bottom 0.254: H1.10 99.88,2.5 24,2.5 19.5,7 19.5,22 21,23.5 21,32.5 19.75,33.75 J2.4
IO17_DUT_VIN  (via drill 0.35)
  Top 0.305: v142,37 R30.1
  Route2 0.305: H1.11 101.3,11.3 102,12 104,14 110,14 114,18 116,20 116,24 123,31 124,32 136,32 137,32 v142,37
IO18_!TESTER_RST  (via drill 0.35)
  Top 0.254: 79.3,56.9 79.4,57 | 83.6,58.6 83.7,58.7
  Top 0.305: H1.12 100,7.76 100,12 100,13.76 R26.1 100,14.24 v100,16 | IC9.3 12.28,62.73 v13,62 | J4.3 78.8,55.2 78.8,55.7 78.8,56.4 79.3,56.9 | 79.4,57 80.9,57 82,57 83.6,58.6 | 83.7,58.7 83.7,66.3 82.98,67.02 J10.A26
  Route2 0.305: J4.3 79,53 77,53 68,53 J6.3 65.93,52.93 64,52.93 55.07,52.93 J8.3 53,53 49,53 42,53 J11.3 40,53 37.5,53 29,53 J13.3 27,53 23.5,53 16,53 J15.3 14,53 10,53 4.5,53 3.5,54 | v13,62 11.5,62 8.5,59 3.5,54 | 3.5,54 J17.3
  Bottom 0.254: 94,51 92,53 90,53 81,53 J4.3
  Bottom 0.305: v100,16 100,36 98,38 97,39 96,40 96,42 96,49 94,51
IO20_EXT_BUTTON  (via drill 0.35)
  Top 0.305: v37,28 R24.1
  Route2 0.305: H1.38 68.28,4.78 67.5,4 62,4 38,28 v37,28
IO22_DUT_3V3  (via drill 0.35)
  Top 0.305: H1.15 96.22,12.78 95,14 95,22 95,25 100,30 102,32 v105,32 | v106,37 R34.1
  Bottom 0.305: v105,32 105,36 v106,37
IO23_PIEZO
  Top 0.305: H1.16 95,7.68 95,9 95,11 95,11.5 SPKR2.1
IO24
  Route15 0.305: J10.A24 86.8,75 88,75 93,75 93.8,75 94.4,74.4 94.4,73.1 95.7,71.8 95.7,69.5 95.7,69.3 96,69 96,47 96,16 95,15 95,11 95,7.78 H1.18
IO25
  Route14 0.305: J10.A25 84.25,70.05 88.1,66.2 93.8,60.5 93.8,57.3 93.8,38.6 87.7,32.5 84.8,29.6 84.8,8.9 84.8,8.3 85.3,7.8 85.4,7.7 86.1,7.7 87.36,7.7 H1.22
IO27_DUT_5V  (via drill 0.35)
  Top 0.305: v124,37 R32.1
  Route2 0.305: H1.13 98.76,10.76 100,12 105,17 105,19 105,28 108,31 109,32 115,32 119,32 v124,37
IOA0
  Route15 0.305: J10.B28 80.44,75.55 80.1,75.2 79.2,74.3 79.2,74 79.2,73 78.8,72.6 77.9,71.7 77.9,70.6 77.9,68.2 78.7,67.4 83.7,62.4 83.7,62.1 83.7,50.5 83.7,50.3 J5.1
IOA1
  Route15 0.305: J10.A28 80.44,68.66 81.6,67.5 85.1,64 85.1,51.1 85.1,50.9 J5.2
IOA2
  Route14 0.305: J5.3 88.1,48 86.3,49.8 85.8,50.3 85.8,60.3 85.8,61.2 78.4,68.6 77.9,69.1 77.9,70.7 77.9,71.7 78.7,72.5 79.17,72.97 J10.B29
IOA3
  Route14 0.254: 87,51.2 87,56.8
  Route14 0.305: J5.4 88.2,50 87,51.2 | 87,56.8 87,63.37 J10.A29
IOA4
  Route3 0.305: J5.5 88,52 86,54 86,59 75.4,69.6 75.4,71.8 76.6,73 76.6,74.3 77.91,75.61 J10.B30
IOA5
  Route3 0.305: J5.6 88,54 87,55 87,60 77.91,69.09 J10.A30
IOA6
  Route2 0.305: J5.7 89,56 78,67 76,69 75.4,69.6 75.4,71.3 75.4,71.8 76.2,72.6 76.64,73.03 J10.B31
IOA7
  Route2 0.254: 76.81,71.19 J10.A31
  Route2 0.305: J5.8 76.81,71.19
IOA_VIO
  Top 0.305: J10.B27 81.07,76.27 79.5,74.7 79.2,74.4 79.2,73.6 79.2,73 80,72.2 80.5,71.7 80.5,70.7 80.5,68.7 80,68.2 J4.1
IOB0
  Route15 0.305: J7.1 72.8,48.2 72.8,69.7 72.8,71.8 73.6,72.6 74.09,73.09 J10.B33
IOB1
  Route15 0.305: J7.2 74.09,48.91 J10.A33
IOB2
  Route14 0.305: J7.3 70.3,54.7 70.3,70.6 70.3,71.8 71.5,73 71.6,73.1 71.6,73.8 71.6,74.3 72.6,75.3 72.83,75.53 J10.B34
IOB3
  Route14 0.305: J7.4 72.83,54.17 J10.A34
IOB4
  Route3 0.305: J7.5 70.3,58.7 70.3,71.8 71.56,73.06 J10.B35
IOB5
  Route3 0.305: J7.6 71.56,59.45 J10.A35
IOB6
  Route2 0.305: J7.7 67.7,65.3 67.7,70.7 67.7,71.7 68.6,72.6 69,73 69,73.9 69,74.3 69.9,75.2 70.28,75.58 J10.B36
IOB7
  Route2 0.305: J7.8 70.28,64.72 J10.A36
IOB_VIO
  Top 0.254: 72.8,70.5 72.8,70.4
  Top 0.305: J10.B32 75.36,75.77 74.6,75 74.1,74.5 74.1,73.6 74.1,73.2 73.2,72.3 72.8,71.9 72.8,70.5 72.8,69.8 72,69 67,64 J6.1
IOC0
  Route15 0.305: J9.1 58.6,49.4 58.6,59.8 65.2,66.4 65.2,71.8 66.5,73.1 66.5,74.3 67.75,75.55 J10.B38
IOC1
  Route15 0.305: J9.2 59.7,50.3 59.7,59.1 67.75,67.14 J10.A38
IOC2
  Route14 0.305: J9.3 60.6,51.4 60.6,55.9 60.6,61.4 63.7,64.5 65.2,66 65.2,70 65.2,71.8 65.9,72.5 66.47,73.08 J10.B39
IOC3
  Route14 0.305: J9.4 61.8,52.2 61.8,59.6 61.8,60.1 64.6,62.9 66.47,64.78 J10.A39
IOC4
  Route3 0.305: J9.5 62.6,53.4 62.6,71.7 63.9,73 63.9,74.3 65.2,75.61 J10.B40
IOC5
  Route3 0.305: J9.6 65.2,55.2 J10.A40
IOC6
  Route2 0.254: J9.7 62.6,57.4
  Route2 0.305: 62.6,57.4 62.6,70.7 62.6,71.7 63.4,72.5 63.94,73.03 J10.B41
IOC7
  Route2 0.254: 64,71.12 J10.A41
  Route2 0.305: J9.8 64,71.12
  Bottom 0.305: 63.94,71.06 J10.A41
IOC_VIO
  Top 0.254: 61.5,69 54,61.5 J8.1
  Top 0.305: J10.B37 69.02,73.22 68.5,72.7 67.7,71.9 67.7,70.7 67.7,70.3 66.4,69 61.5,69
IOD0
  Route15 0.305: J12.1 48.4,46.6 48.4,59.1 60.1,70.8 60.1,71.7 61.4,73 J10.B43
IOD1
  Route15 0.305: J12.2 49.3,47.7 49.3,58.3 61.4,70.39 J10.A43
IOD2
  Route14 0.305: J12.3 47.8,51.2 47.8,53.6 47.8,58.9 56.7,67.8 57.6,68.7 57.6,71 57.6,71.7 58.5,72.6 58.8,72.9 58.8,74.1 58.8,74.3 59.5,75 60.12,75.62 J10.B44
IOD3
  Route14 0.305: J12.4 48.9,52.1 48.9,55 48.9,58.8 52.4,62.3 60.12,70.03 J10.A44
IOD4
  Route3 0.305: J12.5 47.6,55.4 47.6,59.2 57.6,69.2 57.6,71.8 58.85,73.06 J10.B45
IOD5
  Route3 0.305: J12.6 48.7,56.3 48.7,58 58.85,68.16 J10.A45
IOD6
  Route2 0.305: J12.7 49,58 49,58.8 49,59.1 54.5,64.6 55.1,65.2 55.1,70.8 55.1,71.8 56.1,72.8 56.3,73 56.3,73.9 56.3,74.3 57,75 57.59,75.58 J10.B46
IOD7
  Route2 0.305: J12.8 57.59,64.58 J10.A46
IOD_VIO
  Top 0.305: J10.B42 62.66,75.77 61.8,74.9 61.3,74.4 61.3,73.6 61.3,73.1 60.3,72.1 60.2,72 60.2,70.6 60.2,70.3 59.1,69.2 56.4,66.5 44,66.5 41,63.5 J11.1
IOE0
  Route15 0.305: J14.1 34.7,47.3 34.7,59.8 36.8,61.9 47,61.9 52.5,67.4 52.5,71.8 53.8,73.1 53.8,74.3 55.05,75.55 J10.B48
IOE1
  Route15 0.305: J14.2 35.8,48.2 35.8,59.6 37.4,61.2 48,61.2 55.05,68.25 J10.A48
IOE2
  Route14 0.305: J14.3 34.7,51.3 34.7,53.9 34.7,59.3 36.4,61 36.9,61.5 44.5,61.5 46.1,61.5 51.8,67.2 52.5,67.9 52.5,70.4 52.5,71.8 53.5,72.8 53.77,73.08 J10.B49
IOE3
  Route14 0.305: J14.4 35.9,52.1 35.9,55.1 35.9,59 37.2,60.3 37.4,60.5 42.3,60.5 46.7,60.5 50.3,64.1 53.77,67.58 J10.A49
IOE4
  Route3 0.305: J14.5 35.2,54.8 35.2,59.2 36.9,60.9 45.5,60.9 50,65.4 50,71.9 51.2,73.1 51.2,74.3 52.51,75.61 J10.B50
IOE5
  Route3 0.305: J14.6 36.1,55.9 36.1,58.7 37.3,59.9 45.9,59.9 52.51,66.5 J10.A50
IOE6
  Route2 0.305: J14.7 36.9,56 36.1,56.8 36.1,58.3 36.6,58.8 38.8,61 40.9,61 46.2,61 48.7,63.5 50,64.8 50,71 50,71.9 50.8,72.7 51.23,73.14 J10.B51
IOE7
  Route2 0.305: J10.A51 51.23,64.44 47.1,60.3 46.6,59.8 39.8,59.8 J14.8
IOE_VIO
  Top 0.305: J10.B47 56.31,73.22 55.5,72.4 55.1,72 55.1,70.8 55.1,70.5 52.8,68.2 52.1,67.5 39.5,67.5 31,67.5 28,64.5 J13.1
IOF0
  Route15 0.305: J16.1 21.5,47.5 21.5,59.4 26.6,64.5 44.3,64.5 47.4,67.6 47.4,71.8 48.7,73.09 J10.B53
IOF1
  Route15 0.305: J16.2 22.6,48.4 22.6,58.7 27.1,63.2 45.5,63.2 48.7,66.39 J10.A53
IOF2
  Route14 0.305: J16.3 21.9,51.1 21.9,58.9 21.9,59.9 25.3,63.3 25.7,63.7 32.4,63.7 41.8,63.7 44.7,66.6 44.9,66.8 44.9,70.8 44.9,71.8 45.9,72.8 46.1,73 46.1,73.9 46.1,74.3 47.1,75.3 47.42,75.62 J10.B54
IOF3
  Route14 0.305: J16.4 23,52 23,55 23,59.4 26.3,62.7 35.2,62.7 44.1,62.7 46.2,64.8 47.42,66.03 J10.A54
IOF4
  Route3 0.305: J16.5 22.3,54.7 22.3,59.5 26.4,63.6 41.7,63.6 44.9,66.8 44.9,71.9 46.16,73.16 J10.B55
IOF5
  Route3 0.305: J16.6 23.3,55.7 23.3,59.1 26.9,62.7 42.8,62.7 46.16,66.06 J10.A55
IOF6
  Route2 0.305: J16.7 23.6,57.4 23.6,58.6 27.4,62.4 37.2,62.4 42.4,67.6 42.4,71.8 43.6,73 43.6,74.3 44.88,75.58 J10.B56
IOF7
  Route2 0.305: J16.8 28.3,61.3 37.7,61.3 44.88,68.48 J10.A56
IOF_VIO
  Top 0.254: J10.B52 49.31,78.81 47.4,76.9 47.4,76.2 47.4,75.6 47.2,75.4 46.1,74.3 46.1,74 46.1,73 | 39,68.4 38.9,68.4
  Top 0.305: 46.1,73 45.6,72.5 44.9,71.8 44.9,71.1 44.9,70.2 44.1,69.4 43.1,68.4 39,68.4 27.9,68.4 21.5,62 17.5,58 J15.1
IOG0
  Route15 0.305: J18.1 8.6,47.4 8.6,57.6 12,61 19,61 24.8,66.8 37.8,66.8 39.8,68.8 39.8,71.8 41.1,73.1 41.1,74.4 42.34,75.64 J10.B58
IOG1
  Route15 0.305: J18.2 9.9,48.1 9.9,57.9 12,60 20,60 25.8,65.8 40.5,65.8 42.34,67.64 J10.A58
IOG2
  Route14 0.254: 8.1,56 8.1,56.3 | 38.2,66.7 38.25,66.75
  Route14 0.305: J18.3 8.1,51.9 8.1,56 8.1,58.1 10,60 11,61 15,61 20,61 21,62 24,65 25,66 36,66 37.5,66 38.25,66.75 39.8,68.3 39.8,70.5 39.8,71.8 40.8,72.8 41.08,73.08 J10.B59
IOG3
  Route14 0.305: J18.4 9.3,52.7 9.3,57.5 11.8,60 12,60 18,60 20,60 22,62 25,65 34,65 38.8,65 39.1,65.3 41.08,67.28 J10.A59
IOG4
  Route3 0.254: 34.7,66.2 34.75,66.25
  Route3 0.305: J18.5 9,55 9,58 12,61 20,61 25,66 34.5,66 34.7,66.2 | 34.75,66.25 36.8,68.3 36.8,71.4 38.5,73.1 38.5,74.3 39.8,75.61 J10.B60
IOG5
  Route3 0.305: J18.6 10.2,55.8 10.2,58.2 12,60 21,60 25.8,64.8 27,64.8 36.6,64.8 39.8,68 J10.A60
IOG6
  Route2 0.305: J18.7 10.4,57.6 10.4,58.7 12.7,61 20.5,61 25,65.5 33.9,65.5 36.8,68.4 36.8,71.4 38.53,73.14 J10.B61
IOG7
  Route2 0.305: J10.A61 38.53,68.44 34.3,64.2 25.2,64.2 21,60 14,60 J18.8
IOG_VIO
  Top 0.305: J10.B57 42.97,76.27 41.1,74.4 41.1,73.3 41.1,73.1 40.3,72.3 39.8,71.8 39.8,70.6 39.8,70 39.1,69.3 36,69.3 27.1,69.3 19.5,61.7 18,60.2 9.1,60.2 6.9,58 J17.1
N$2
  Top 0.305: R10.1 LED2.A
N$3
  Top 0.305: C9.1 147.04,17.76 L1.1
  Top 0.813: VR1.8 146.8,15.08 L1.1
N$4
  Top 0.305: R12.1 LED5.A
N$5
  Top 0.305: R13.1 LED6.A
N$8
  Bottom 2.54: J3.+ 33.7,15.6 | 33.7,15.6 F3.1 | F3.2 34.5,15.6 33.7,15.6
N$9
  Top 0.305: J1.1 36.99,30.75 R24.2 R21.1
N$13
  Top 0.305: R15.2 140.33,10.1 VR1.4
N$14
  Top 0.305: Q4.3 99.9,38.95 D4.A 101.03,40.18 K3.2
N$15
  Top 0.305: IC4.14 IC4.15 IC4.16
  Top 1.27: IC4.15 126.38,43.1 K2.P
N$16
  Top 0.305: IC6.16 IC6.15 IC6.14
  Top 1.27: IC6.15 144.38,43.1 K1.P
N$17
  Top 0.305: K1.2 137.03,40.18 D1.A 135.9,38.95 Q2.3
N$18
  Top 0.305: R11.2 R16.1 146.24,8.36 VR1.5
N$19
  Top 0.305: VR1.7 149.63,12.63 150,13 150,15.24 C9.2
N$23
  Top 0.305: LED1.A R8.1
N$24
  Top 0.254: R29.2 R30.2
  Top 0.305: Q2.1 138.19,34.24 R29.2
N$25
  Top 0.61: F2.1 109.5,67 112.97,63.53 K3.S
N$26
  Top 1.27: K2.S 130.97,62.53 126.5,67 F1.1
N$27
  Top 0.305: Q3.3 117.9,38.95 D3.A 119.03,40.18 K2.2
N$28
  Top 0.305: R32.2 R31.2 120.19,34.24 Q3.1
N$32
  Top 0.305: R34.2 R33.2 102.19,34.24 Q4.1
N$34
  Top 0.305: IC5.14 IC5.15 IC5.16
  Top 1.27: IC5.15 108.38,43.1 K3.P
N$39
  Top 0.305: C17.1 129.04,17.76 L2.1
  Top 0.813: VR3.8 128.8,15.08 L2.1
N$40
  Top 0.305: VR3.4 122.33,10.1 R37.2
N$41
  Top 0.305: R35.2 R36.1 128.24,8.36 VR3.5
N$42
  Top 0.305: VR3.7 131.63,12.63 132,13 132,15.24 C17.2
N$43
  Top 0.305: LED4.A R39.1
N$44
  Top 0.305: LED3.A R38.1
N$46
  Top 0.305: R41.2 70.59,45.35 IC7.3
PG  (1 unrouted)
USB1_D+
  Top 0.254: J10.B18 93.14,75.64 92,74.5 91.9,74.4 91.9,73.1 93.2,71.8 93.2,69.5 94.2,68.5 94.2,32.7 94.2,31.4 83.9,21.1 | R53.1 76.76,21.74 78.5,20 80,20 82.8,20 83.9,21.1 | 83.9,21.1 83.6,20.8
USB1_D-  (via drill 0.35)
  Top 0.305: v71,23 R52.1
  Route2 0.254: 90.6,70 90.6,66.4 92,65 93,64 93,59
  Route2 0.305: J10.B19 91.88,73.17 90.6,71.9 90.6,70 90.6,69.7 | v71,23 73,25 77,25 82,25 90,33 93,36 93,59
USB2_D+  (via drill 0.35)
  Top 0.305: v84,23 R46.1
  Route15 0.305: J10.A18 93.14,69.5 93.14,69.34 94,68.49 94,52 94,35.5 93.14,34.65 84,25.5 v84,23
USB2_D-  (via drill 0.35)
  Top 0.254: v80,21 79,21 78.24,21.76 R47.1
  Route2 0.254: J10.A19 91.88,67.12 94,65
  Route2 0.305: 94,65 94,28 87,21 84,21 v80,21
USB3_D+
  Top 0.254: J10.B20 90.61,75.7 89.7,74.8 89.3,74.4 89.3,73.2 90.3,72.2 90.6,71.9 90.6,70.7 90.6,69.4 93,67 93,46 93,37 92,36
  Top 0.305: R55.1 90.76,34.76 92,36
USB3_D-  (via drill 0.35)
  Top 0.305: v90.5,30.5 90.24,30.24 R54.1
  Route14 0.305: v90.5,30.5 97,37 97,56 97,63 91,69 90.6,69.4 90.6,71 90.6,71.8 89.5,72.9 89.33,73.06 J10.B21
USB4_D+  (via drill 0.35)
  Top 0.305: v90,41 89.24,41 R14.1
  Route15 0.305: J10.A20 90.61,69.41 90.61,62.4 93,60 93,43 91,41 v90,41
USB4_D-  (via drill 0.35)
  Top 0.305: R17.1 90.24,36.24 91,37 v91,38
  Route15 0.305: v91,38 89,38 88,39 88,41 89,42 90,42 91,42 92,43 92,58 92,60 91,61 89.33,62.66 J10.A21
USB_N  (via drill 0.35)
  Top 0.254: U$9.B7 61.25,16.75 v62,16 R48.1 | U$9.A7 56.75,17.25 v56,18
  Bottom 0.254: v56,18 60,18 61,17 v62,16
USB_P  (via drill 0.35)
  Top 0.254: U$9.B6 61.25,17.25 v62,18 R49.1 | U$9.A6 56.75,16.75 v56,16
  Route2 0.254: v56,16 60,16 v62,18
V+  (1 unrouted)
  Top 0.127: U$9.A9 U$9.B4 | U$9.A4 U$9.B9
VIN+  (via drill 0.35)
  Top 0.305: IC6.12 146.32,38.33 145.03,37.02 IC6.3 | R13.2 v20,71
  Top 0.508: IC6.3 IC6.2 IC6.1
  Top 0.813: VR3.2 VR3.3 120.03,11.37 C19.1 | VR1.2 VR1.3 138.03,11.37 C2.1
  Top 1.27: C2.1 134.6,11.4 134,12 | C19.1 118.4,11.4 117,10 117,1.8 | IC6.2 144.38,32.38 143,31 142,31
  Top 2.54: C7.+ 45,14.25 40.65,9.9 F3.3 | 142,31 136,31 134,29 134,12 134,4 131.8,1.8 117,1.8 64.2,1.8 51.75,14.25 C7.+ | C18.+ C7.+
  Route15 0.305: v20,71 19,70 11.5,70 10.5,69 10.5,61.5 7,58 7,44 10,41 16.5,41 31,26.5 31,14.9 F3.3
  Bottom 2.54: F3.4 F3.3

## Text on the board
tPlace: v2.2 | Tester Power | DUT Power | 3V3 | 5V | VIN | 3V3 | 5V | VIN | Testomatic | www.testomatic.io | by Jon Oxer | I/O G | I/O F | I/O E | I/O D | I/O C | I/O B | I/O A | 48-55 | 40-47 | 32-39 | 24-31 | 16-23 | 8-15 | 0-7 | IR Camera | Ext Button | RXi | TXo | GND | 3V3 | VIN: 12Vdc | FUSE: 10A | SKU: TESTOMATIC
bPlace: (C)2025 SuperHouse Automation Pty Ltd | www.superhouse.tv/testomatic | Made in / Australia